# Altium schematic sheet Indictor_1.SchDoc
size A4
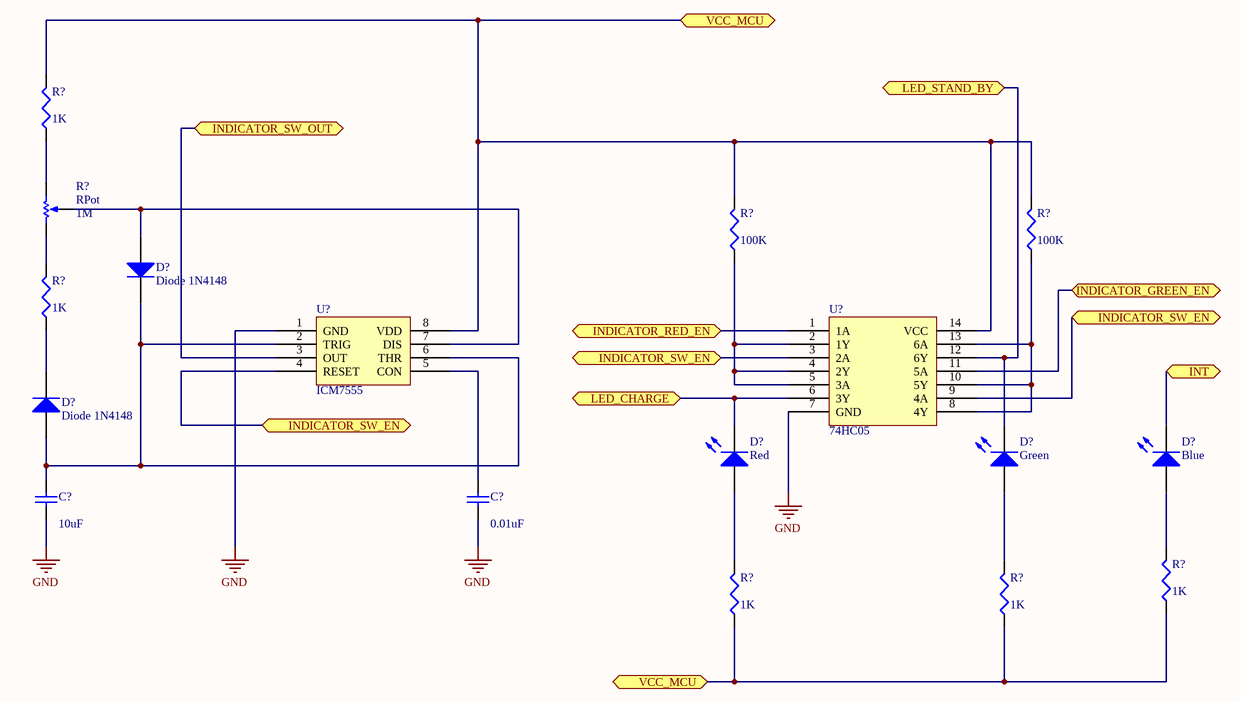
[diagram p0: Indictor_1.SchDoc]

## Parts
(Parts that share a designator on the sheet are numbered #1, #2 ... from top to bottom, then left to right.)
C?#1  value 10uF  [C1206]  (hidden comment: Cap Semi)
C?#2  value 0.01uF  [C1206]  (hidden comment: Cap Semi)
D?#1  Diode 1N4148  [DO-41]
D?#2  Diode 1N4148  [DO-41]
D?#3  Red  [3.2X1.6X1.1]
D?#4  Green  [3.2X1.6X1.1]
D?#5  Blue  [3.2X1.6X1.1]
R?#1  value 1K  [12Z-2010]  (hidden comment: Res3)
R?#2  RPot  value 1M  [VR5]
R?#3  value 100K  [12Z-2010]  (hidden comment: Res3)
R?#4  value 100K  [12Z-2010]  (hidden comment: Res3)
R?#5  value 1K  [12Z-2010]  (hidden comment: Res3)
R?#6  value 1K  [12Z-2010]  (hidden comment: Res3)
R?#7  value 1K  [12Z-2010]  (hidden comment: Res3)
R?#8  value 1K  [12Z-2010]  (hidden comment: Res3)
U?#1  ICM7555
U?#2  74HC05

## Ports
INDICATOR_GREEN_EN (bidir), INDICATOR_RED_EN (bidir), INDICATOR_SW_EN (bidir), INDICATOR_SW_OUT (bidir), INT (bidir), LED_CHARGE (bidir), LED_STAND_BY (bidir), VCC_MCU (bidir)

## Nets
GND: C?#1.1 C?#2.1 U?#1.1(GND) U?#2.7(GND)
INDICATOR_GREEN_EN: U?#2.11(5A) ; port INDICATOR_GREEN_EN
INDICATOR_RED_EN: U?#2.1(1A) ; port INDICATOR_RED_EN
INDICATOR_SW_EN: U?#1.4(RESET) U?#2.3(2A) U?#2.9(4A) ; port INDICATOR_SW_EN
INDICATOR_SW_OUT: U?#1.3(OUT) ; port INDICATOR_SW_OUT
INT: D?#5.2(K) ; port INT
LED_CHARGE: D?#3.2(K) U?#2.6(3Y) ; port LED_CHARGE
LED_STAND_BY: D?#4.2(K) U?#2.12(6Y) ; port LED_STAND_BY
VCC_MCU: R?#1.2 R?#3.2 R?#4.2 R?#6.1 R?#7.1 R?#8.1 U?#1.8(VDD) U?#2.14(VCC) ; port VCC_MCU
NetC?#1_2: C?#1.2 D?#1.2(K) D?#2.1(A) U?#1.2(TRIG) U?#1.6(THR)
NetC?#2_2: C?#2.2 U?#1.5(CON)
NetD?#1_1: D?#1.1(A) R?#2.3(TAP) U?#1.7(DIS)
NetD?#2_2: D?#2.2(K) R?#5.1
NetD?#3_1: D?#3.1(A) R?#7.2
NetD?#4_1: D?#4.1(A) R?#8.2
NetD?#5_1: D?#5.1(A) R?#6.2
NetR?#1_1: R?#1.1 R?#2.1(TOP)
NetR?#2_2: R?#2.2(BOT) R?#5.2
NetR?#3_1: R?#3.1 U?#2.2(1Y) U?#2.4(2Y) U?#2.5(3A)
NetR?#4_1: R?#4.1 U?#2.8(4Y) U?#2.10(5Y) U?#2.13(6A)

## Library data of the parts
C?#1 C?#2 = Cap Semi: Capacitor (Semiconductor SIM Model); Published: 8-Jun-2000; LatestRevisionDate: 29-May-2009; LatestRevisionNote: IPC-7351 Footprint Added.; PackageReference: C1206; Publisher: Altium Limited; PackageDescription: Chip Capacitor
D?#1 D?#2 = Diode 1N4005: 1 Amp General Purpose Rectifier; Published: 8-Jun-2000; LatestRevisionDate: 17-Jul-2002; LatestRevisionNote: Re-released for DXP Platform.; DatasheetVersion: 1998; PackageVersion: Aug-1999; PackageReference: DO-41; Publisher: Altium Limited; PackageDescription: Diode, Axial; Body 5.2 x 2.7 mm (LxDia. max), Lead Dia. 0.86 mm (max); Code_JEDEC: DO-204-AL; ComponentLink1Description: Manufacturer Link; ComponentLink1URL: http://www.fairchildsemi.com/; ComponentLink2Description: Datasheet; ComponentLink2URL: http://www.fairchildsemi.com/ds/1N%2F1N4001.pdf
D?#3-D?#5 = LED2: Typical RED, GREEN, YELLOW, AMBER GaAs LED; Published: 8-Jun-2000; LatestRevisionDate: 17-Jul-2002; LatestRevisionNote: Re-released for DXP Platform.; PackageVersion: Feb-2002; PackageReference: 3.2X1.6X1.1; Publisher: Altium Limited; PackageDescription: SM LED; 2 Flat Leads
R?#1 R?#3-R?#8 = Res3: Resistor; Published: 8-Jun-2000; LatestRevisionDate: 29-May-2009; LatestRevisionNote: IPC-7351 Footprint Added.; PackageReference: J1-0603; Publisher: Altium Limited; PackageDescription: Chip Resistor
R?#2 = RPot: Potentiometer; Sim Note: Enter the Resistance value and the set point into parameter fields.; Set Position: 0.5; Published: 8-Jun-2000; LatestRevisionDate: 17-Jul-2002; LatestRevisionNote: Re-released for DXP Platform.; PackageReference: VR5; Publisher: Altium Limited; PackageDescription: Variable Resistor, Thru-Hole; 3 Leads